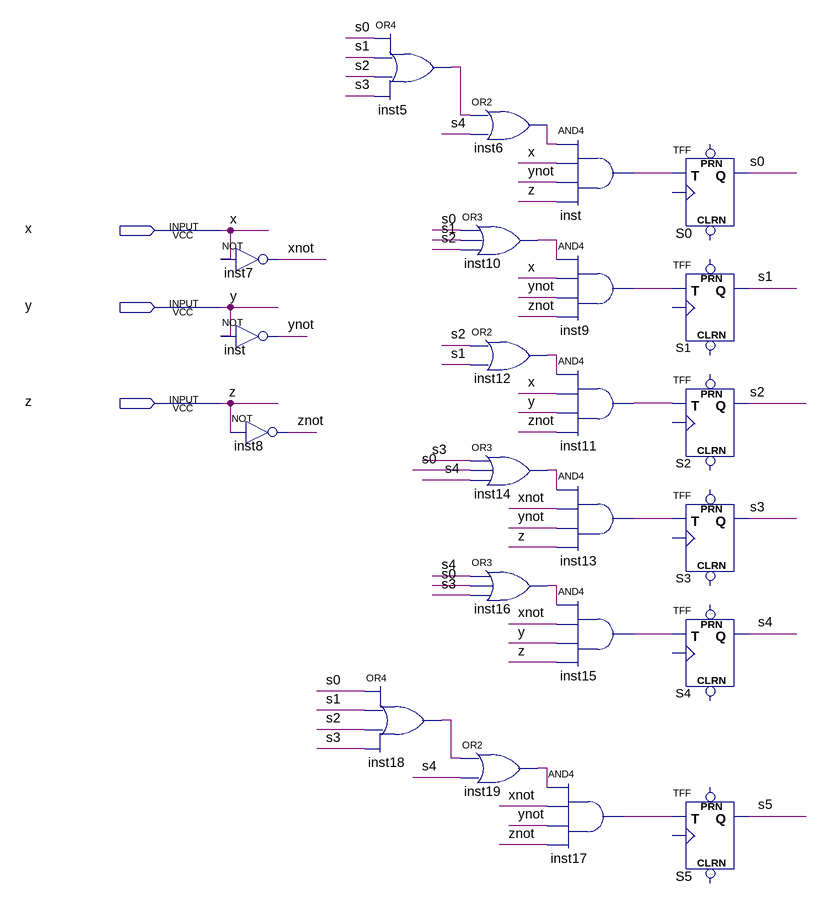
[diagram p0: schematic sheet]
// Quartus schematic State Machine.bdf as structural Verilog: 23 symbols, 3 pins
module \State_Machine  (
  input  x,
  input  y,
  input  z
);

  wire inst5_out, inst6_out, inst9_out, inst10_out, inst11_out, inst12_out, inst13_out, inst14_out,
       inst15_out, inst16_out, inst17_out, inst18_out, inst19_out, inst_out, s0, s1, s2, s3, s4, s5, xnot,
       ynot, znot;

  not inst7 (xnot, x);
  not inst (ynot, y);
  not inst8 (znot, z);
  or inst5 (inst5_out, s0, s1, s2, s3);
  or inst18 (inst18_out, s0, s1, s2, s3);
  or inst6 (inst6_out, inst5_out, s4);
  or inst10 (inst10_out, s0, s1, s2);
  or inst12 (inst12_out, s2, s1);
  or inst14 (inst14_out, s3, s0, s4);
  or inst16 (inst16_out, s4, s0, s3);
  or inst19 (inst19_out, inst18_out, s4);
  and inst_dup2 (inst_out, inst6_out, x, ynot, z);
  and inst9 (inst9_out, inst10_out, x, ynot, znot);
  and inst11 (inst11_out, inst12_out, x, y, znot);
  and inst13 (inst13_out, inst14_out, xnot, ynot, z);
  and inst15 (inst15_out, inst16_out, xnot, y, z);
  and inst17 (inst17_out, inst19_out, xnot, ynot, znot);
  TFF u_S0 (.T(inst_out), .Q(s0));  // open: PRN, CLRN, CLK
  TFF u_S1 (.T(inst9_out), .Q(s1));  // open: PRN, CLRN, CLK
  TFF u_S2 (.T(inst11_out), .Q(s2));  // open: PRN, CLRN, CLK
  TFF u_S3 (.T(inst13_out), .Q(s3));  // open: PRN, CLRN, CLK
  TFF u_S4 (.T(inst15_out), .Q(s4));  // open: PRN, CLRN, CLK
  TFF u_S5 (.T(inst17_out), .Q(s5));  // open: PRN, CLRN, CLK
endmodule
